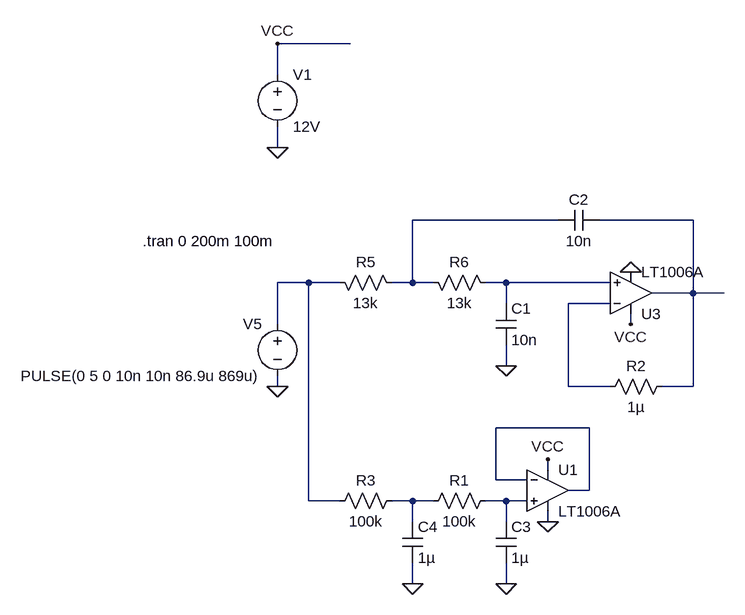
[diagram p0: schematic sallen_key_dac.asc.asc]
sallen_key_dac.asc.asc, the LTspice schematic file:
Version 4
SHEET 1 1580 1076
WIRE -80 224 -192 224
WIRE -192 272 -192 224
WIRE -192 384 -192 352
WIRE 240 496 16 496
WIRE 448 496 304 496
WIRE -144 592 -192 592
WIRE -96 592 -144 592
WIRE 16 592 16 496
WIRE 16 592 -16 592
WIRE 48 592 16 592
WIRE 160 592 128 592
WIRE 320 592 160 592
WIRE 448 608 448 496
WIRE 448 608 384 608
WIRE 496 608 448 608
WIRE 160 624 160 592
WIRE 320 624 256 624
WIRE -192 656 -192 592
WIRE 352 656 352 640
WIRE 160 720 160 688
WIRE -192 752 -192 736
WIRE 256 752 256 624
WIRE 320 752 256 752
WIRE 448 752 448 608
WIRE 448 752 400 752
WIRE 288 816 144 816
WIRE 224 880 224 864
WIRE 144 896 144 816
WIRE 192 896 144 896
WIRE 288 912 288 816
WIRE 288 912 256 912
WIRE -144 928 -144 592
WIRE -96 928 -144 928
WIRE 16 928 -16 928
WIRE 48 928 16 928
WIRE 160 928 128 928
WIRE 192 928 160 928
WIRE 16 960 16 928
WIRE 160 960 160 928
WIRE 224 960 224 944
WIRE 16 1056 16 1024
WIRE 160 1056 160 1024
FLAG -192 752 0
FLAG 160 720 0
FLAG 352 576 0
FLAG -192 384 0
FLAG -192 224 VCC
FLAG 352 656 VCC
FLAG 224 864 VCC
FLAG 224 960 0
FLAG 160 1056 0
FLAG 16 1056 0
SYMBOL voltage -192 256 R0
WINDOW 123 0 0 Left 2
WINDOW 39 0 0 Left 2
SYMATTR InstName V1
SYMATTR Value 12V
SYMBOL voltage -192 640 M0
WINDOW 123 0 0 Left 2
WINDOW 39 0 0 Left 2
SYMATTR InstName V5
SYMATTR Value PULSE(0 5 0 10n 10n 86.9u 869u)
SYMBOL Opamps\\LT1006A 352 672 M180
SYMATTR InstName U3
SYMBOL cap 240 480 M90
WINDOW 0 0 32 VBottom 2
WINDOW 3 32 32 VTop 2
SYMATTR InstName C2
SYMATTR Value 10n
SYMBOL res -112 576 M90
WINDOW 0 0 56 VBottom 2
WINDOW 3 32 56 VTop 2
SYMATTR InstName R5
SYMATTR Value 13k
SYMBOL res 32 576 M90
WINDOW 0 0 56 VBottom 2
WINDOW 3 32 56 VTop 2
SYMATTR InstName R6
SYMATTR Value 13k
SYMBOL res 416 736 R90
WINDOW 0 0 56 VBottom 2
WINDOW 3 32 56 VTop 2
SYMATTR InstName R2
SYMATTR Value 1µ
SYMBOL cap 144 624 R0
SYMATTR InstName C1
SYMATTR Value 10n
SYMBOL Opamps\\LT1006A 224 848 R0
SYMATTR InstName U1
SYMBOL res 144 912 R90
WINDOW 0 0 56 VBottom 2
WINDOW 3 32 56 VTop 2
SYMATTR InstName R1
SYMATTR Value 100k
SYMBOL cap 144 960 R0
SYMATTR InstName C3
SYMATTR Value 1µ
SYMBOL cap 0 960 R0
SYMATTR InstName C4
SYMATTR Value 1µ
SYMBOL res 0 912 R90
WINDOW 0 0 56 VBottom 2
WINDOW 3 32 56 VTop 2
SYMATTR InstName R3
SYMATTR Value 100k
TEXT -400 528 Left 2 !.tran 0 200m 100m

The netlist it stands for:
* sallen_key_dac.asc.asc
V1 VCC 0 12V
V5 N003 0 PULSE(0 5 0 10n 10n 86.9u 869u)
XU3 N004 N005 VCC 0 N002 LT1006A  ; pins In+ In- V+ V- OUT
C2 N001 N002 10n
R5 N003 N001 13k
R6 N001 N004 13k
R2 N002 N005 1µ
C1 N004 0 10n
XU1 N008 N006 VCC 0 N006 LT1006A  ; pins In+ In- V+ V- OUT
R1 N008 N007 100k
C3 N008 0 1µ
C4 N007 0 1µ
R3 N007 N003 100k
.tran 0 200m 100m
.backanno
.end